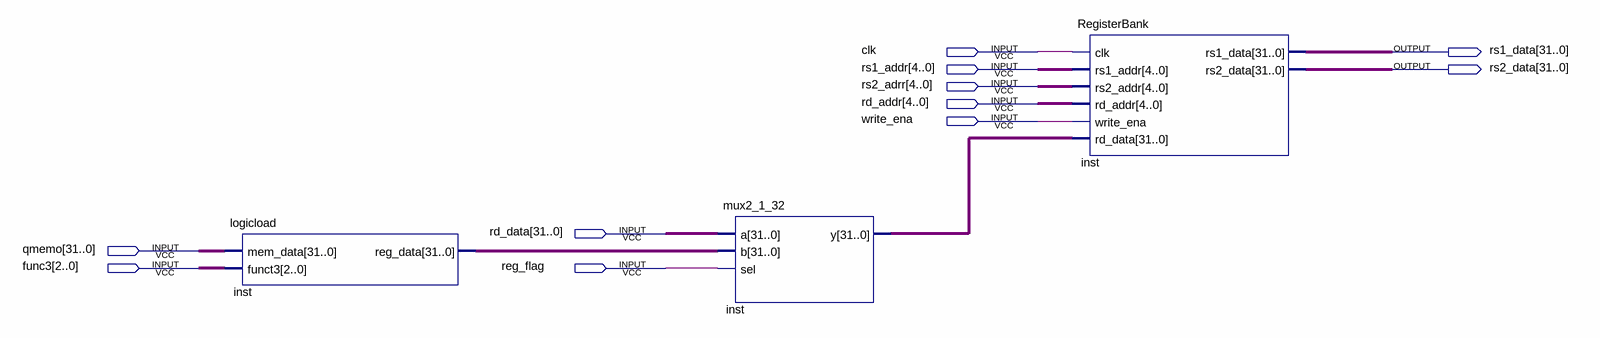
[diagram p0: schematic sheet]
// Quartus schematic test1.bdf as structural Verilog: 3 symbols, 11 pins
module test1 (
  input  clk,
  input  [4:0] rs1_addr,
  input  [4:0] rs2_adrr,
  input  [4:0] rd_addr,
  input  write_ena,
  input  [31:0] rd_data,
  input  [31:0] qmemo,
  input  [2:0] func3,
  input  reg_flag,
  output [31:0] rs1_data,
  output [31:0] rs2_data
);

  wire [31:0] inst_reg_data, inst_y;

  logicload inst (.mem_data(qmemo), .funct3(func3), .reg_data(inst_reg_data));
  mux2_1_32 inst_dup2 (.a(rd_data), .b(inst_reg_data), .sel(reg_flag), .y(inst_y));
  RegisterBank inst_dup3 (
    .clk(clk), .rs1_addr(rs1_addr), .rs2_addr(rs2_adrr), .rd_addr(rd_addr), .write_ena(write_ena),
    .rd_data(inst_y), .rs1_data(rs1_data), .rs2_data(rs2_data));
endmodule
